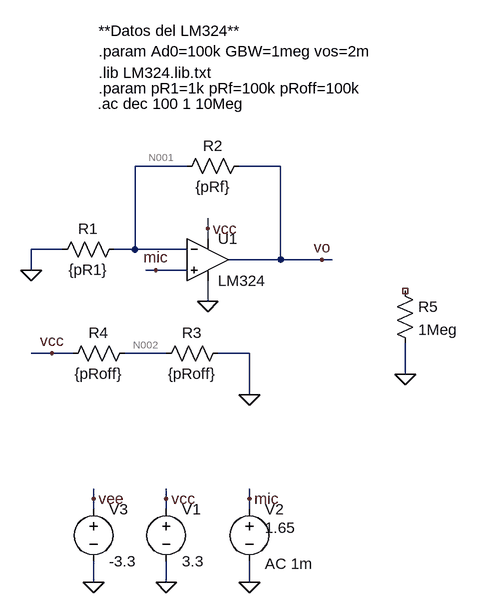
[diagram p0: schematic preamp.asc]
preamp.asc, the LTspice schematic file:
Version 4
SHEET 1 1848 724
WIRE 208 64 128 64
WIRE 352 64 288 64
WIRE 240 160 240 144
WIRE 240 176 240 160
WIRE 16 192 -32 192
WIRE 128 192 128 64
WIRE 128 192 96 192
WIRE 208 192 128 192
WIRE 352 208 352 64
WIRE 352 208 272 208
WIRE 416 208 352 208
WIRE 432 208 416 208
WIRE -32 224 -32 192
WIRE 160 224 144 224
WIRE 208 224 160 224
WIRE 240 272 240 240
WIRE 0 352 -32 352
WIRE 32 352 0 352
WIRE 176 352 112 352
WIRE 304 352 256 352
WIRE 544 384 544 336
WIRE 304 416 304 352
WIRE 64 576 64 560
WIRE 176 576 176 560
WIRE 304 576 304 560
WIRE 64 592 64 576
WIRE 176 592 176 576
WIRE 304 592 304 576
WIRE 64 704 64 672
WIRE 176 704 176 672
WIRE 304 704 304 672
FLAG 176 704 0
FLAG 176 576 vcc
FLAG 240 160 vcc
FLAG 304 704 0
FLAG 304 576 mic
FLAG 304 416 0
FLAG 0 352 vcc
FLAG 544 384 0
FLAG 160 224 mic
FLAG 416 208 vo
FLAG 64 704 0
FLAG 64 576 vee
FLAG -32 224 0
FLAG 240 272 0
SYMBOL voltage 176 576 R0
WINDOW 123 0 0 Left 0
WINDOW 39 0 0 Left 0
SYMATTR InstName V1
SYMATTR Value 3.3
SYMBOL voltage 304 576 R0
WINDOW 3 24 44 Left 2
WINDOW 123 24 100 Left 2
WINDOW 39 24 44 Left 2
SYMATTR Value 1.65
SYMATTR Value2 AC 1m
SYMATTR InstName V2
SYMBOL res 112 176 R90
WINDOW 0 0 56 VBottom 2
WINDOW 3 32 56 VTop 2
SYMATTR InstName R1
SYMATTR Value {pR1}
SYMBOL res 304 48 R90
WINDOW 0 0 56 VBottom 2
WINDOW 3 32 56 VTop 2
SYMATTR InstName R2
SYMATTR Value {pRf}
SYMBOL res 272 336 R90
WINDOW 0 0 56 VBottom 2
WINDOW 3 32 56 VTop 2
SYMATTR InstName R3
SYMATTR Value {pRoff}
SYMBOL res 128 336 R90
WINDOW 0 0 56 VBottom 2
WINDOW 3 32 56 VTop 2
SYMATTR InstName R4
SYMATTR Value {pRoff}
SYMBOL res 528 240 R0
SYMATTR InstName R5
SYMATTR Value 1Meg
SYMBOL voltage 64 576 R0
WINDOW 123 0 0 Left 0
WINDOW 39 0 0 Left 0
SYMATTR InstName V3
SYMATTR Value -3.3
SYMBOL OpAmps\\opamp2 240 144 R0
SYMATTR InstName U1
SYMATTR Value LM324
TEXT 72 -56 Left 2 !.param pR1=1k pRf=100k pRoff=100k
TEXT 72 -80 Left 2 !.lib LM324.lib.txt
TEXT 72 -144 Left 2 !**Datos del LM324**\n.param Ad0=100k GBW=1meg vos=2m
TEXT 70 -32 Left 2 !.ac dec 100 1 10Meg

The netlist it stands for:
* preamp.asc
V1 vcc 0 3.3
V2 mic 0 1.65 AC 1m
R1 N001 0 {pR1}
R2 vo N001 {pRf}
R3 0 N002 {pRoff}
R4 N002 vcc {pRoff}
R5 NC_01 0 1Meg
V3 vee 0 -3.3
XU1 mic N001 vcc 0 vo LM324  ; pins In+ In- V+ V- OUT
.param pR1=1k pRf=100k pRoff=100k
.lib LM324.lib.txt
**Datos del LM324**
.param Ad0=100k GBW=1meg vos=2m
.ac dec 100 1 10Meg
.backanno
.end

* Results of the author's LTspice run, read from the files saved beside the schematic
* Operating Point, zero values left out:
*   V(vcc) = 3.3 V
*   V(mic) = 1.65 V
*   V(n001) = 17.82 mV
*   V(vo) = 1.796 V
*   V(n002) = 1.65 V
*   V(vee) = -3.3 V
*   I(R4) = -16.5 µA
*   I(R3) = -16.5 µA
*   I(R2) = 17.78 µA
*   I(R1) = 17.82 µA
*   I(V2) = -2.654 pA
*   I(V1) = -127.4 µA
*   Ix(u1:1) = 2.654 pA
*   Ix(u1:2) = -40.2 nA
*   Ix(u1:3) = 110.9 µA
*   Ix(u1:4) = -118.9 µA
*   Ix(u1:5) = -17.78 µA
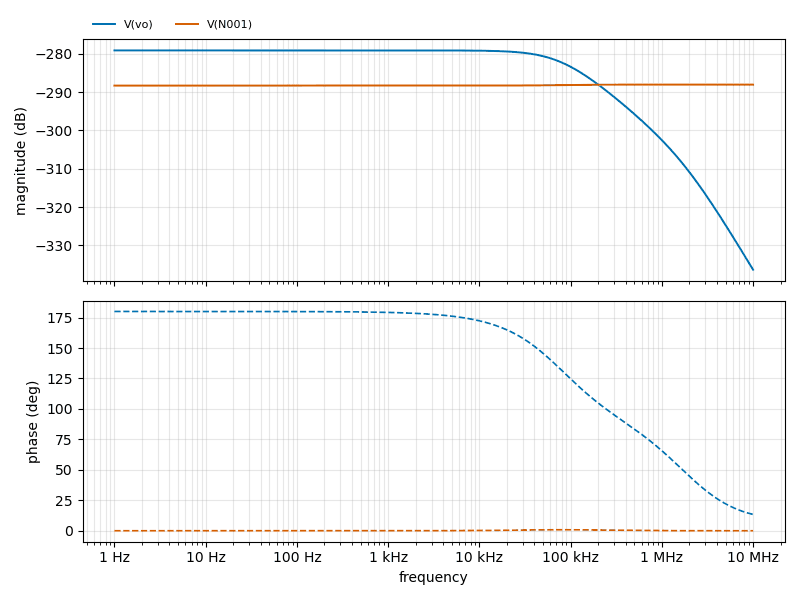
[diagram p1: AC Analysis of preamp.asc, plotted from the saved traces]
* AC Analysis, 1 run:
*   V(vo): -279.15 dB at 1 Hz, -336.33 dB at 10 MHz, peak -279.15 dB at 1 Hz, 3 dB below the peak at 77.41 kHz
*   V(N001): -288.33 dB at 1 Hz, -288.08 dB at 10 MHz, peak -288.08 dB at 912 kHz